# Altium project PCB_Project2.PrjPCB
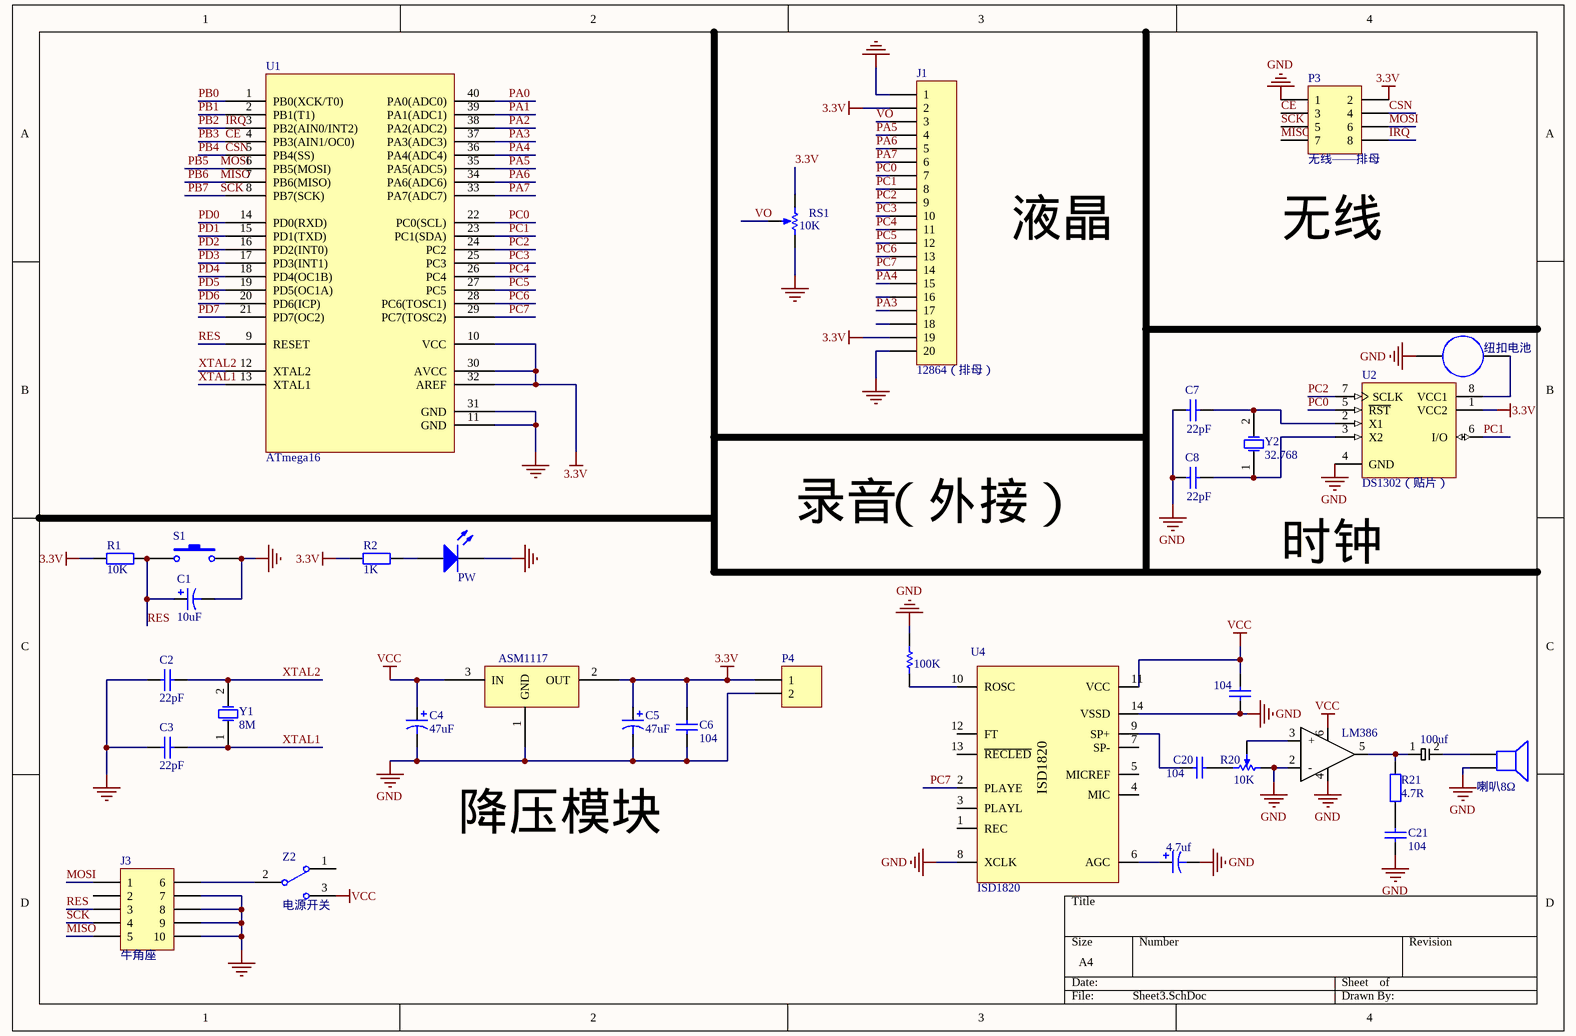
[diagram p0: Sheet3.SchDoc]
1 sheet, 35 parts. Net scope: global (net labels, ports and power ports of the same name join across sheets).
Board file: PCB1.PcbDoc

## Sheet Sheet3.SchDoc
size A4

### Parts
100K  value 100K  [0805]  (hidden comment: Res1)
100uf  (no value)  [电容]
104  value 104  [电容涤纶223]  (hidden comment: Cap)
1117_3.3V  ASM1117  [AMS1117-3.3V  SOT-223  贴片]
C1  value 10uF  [电容]
C2  value 22pF  [电容22pF]
C3  value 22pF  [电容22pF]
C4  value 47uF  [电容]
C5  value 47uF  [电容]
C6  value 104  [电容涤纶223]  (hidden comment: Cap)
C7  value 22pF  [电容22pF]  (hidden comment: Cap)
C8  value 22pF  [电容22pF]  (hidden comment: Cap)
C10  value 4.7uf  [电容]  (hidden comment: Cap Pol1)
C20  value 104  [电容22pF]
C21  value 104  [电容CBB224(0.22)]
J1  12864（排母）  [12864]
J3  牛角座  [下载口（12345）]
LM386  (no value)  [DIP 8]
LS  喇叭8Ω  [2排针]
P3  无线——排母  [无线模块]
P4  Header 2  [2排针]  (value not drawn)
PW  (no value)  [LED]
R1  value 10K  [0805]
R2  value 1K  [0805]
R20  10K  [小电位器]
R21  value 4.7R  [0805]
RS1  value 10K  [小电位器]
S1  (no value)  [4脚按键]
U1  ATmega16  [DIP 40 单片机]
U2  DS1302（贴片）  [SOP8（DS1302）]
U4  ISD1820  [14脚IC]
Y1  8M  [晶振]
Y2  32.768  [晶振]
Z2  电源开关  [自锁开关]
  纽扣电池  [电池座]

### Nets
3.3V: 1117_3.3V.2(OUT) C5.1 C6.1 J1.2 J1.19 P3.2 P4.1 R1.1 R2.1 RS1.1(TOP) U1.10(VCC) U1.30(AVCC) U1.32(AREF) U2.1(VCC2)
GND: 100K.1 104.1 1117_3.3V.1(GND) C1.2 C2.1 C3.1 C4.2 C5.2 C6.2 C7.1 C8.1 C10.2 C21.1 J1.1 J1.20 J3.7 J3.8 J3.9 J3.10 LM386.2(-) LM386.4 LS.2 P3.1 P4.2 PW.2(K) R20.3 RS1.2(BOT) S1.2 U1.11(GND) U1.31(GND) U2.4(GND) U4.8(XCLK) U4.14(VSSD) .2
VCC: 104.2 1117_3.3V.3(IN) C4.1 LM386.6 U4.11(VCC) Z2.3
CE: P3.3 U1.4(PB3(AIN1/OC0))  [also labelled PB3]
CSN: P3.4 U1.5(PB4(SS))  [also labelled PB4]
IRQ: P3.8 U1.3(PB2(AIN0/INT2))  [also labelled PB2]
MISO: J3.5 P3.7 U1.7(PB6(MISO))  [also labelled PB6]
MOSI: J3.1 P3.6 U1.6(PB5(MOSI))  [also labelled PB5]
PA0: U1.40(PA0(ADC0))
PA1: U1.39(PA1(ADC1))
PA2: U1.38(PA2(ADC2))
PA3: J1.17 U1.37(PA3(ADC3))
PA4: J1.15 U1.36(PA4(ADC4))
PA5: J1.4 U1.35(PA5(ADC5))
PA6: J1.5 U1.34(PA6(ADC6))
PA7: J1.6 U1.33(PA7(ADC7))
PB0: U1.1(PB0(XCK/T0))
PB1: U1.2(PB1(T1))
PB7: J3.4 P3.5 U1.8(PB7(SCK))  [also labelled SCK]
PC0: J1.7 U1.22(PC0(SCL)) U2.5(~{RST})
PC1: J1.8 U1.23(PC1(SDA)) U2.6(I/O)
PC2: J1.9 U1.24(PC2) U2.7(SCLK)
PC3: J1.10 U1.25(PC3)
PC4: J1.11 U1.26(PC4)
PC5: J1.12 U1.27(PC5)
PC6: J1.13 U1.28(PC6(TOSC1))
PC7: J1.14 U1.29(PC7(TOSC2)) U4.2(PLAYE)
PD0: U1.14(PD0(RXD))
PD1: U1.15(PD1(TXD))
PD2: U1.16(PD2(INT0))
PD3: U1.17(PD3(INT1))
PD4: U1.18(PD4(OC1B))
PD5: U1.19(PD5(OC1A))
PD6: U1.20(PD6(ICP))
PD7: U1.21(PD7(OC2))
RES: C1.1 J3.3 R1.2 S1.1 U1.9(RESET)
VO: J1.3 RS1.3(TAP)
XTAL1: C3.2 U1.13(XTAL1) Y1.1(OSC1)
XTAL2: C2.2 U1.12(XTAL2) Y1.2(OSC2)
Net100K_2: 100K.2 U4.10(ROSC)
Net100uf_1: 100uf.1 LM386.5 R21.2
Net100uf_2: 100uf.2 LS.1
NetC7_2: C7.2 U2.2(X1) Y2.2(OSC2)
NetC8_2: C8.2 U2.3(X2) Y2.1(OSC1)
NetC10_1: C10.1 U4.6(AGC)
NetC20_1: C20.1 U4.9(SP+)
NetC20_2: C20.2 R20.1
NetC21_2: C21.2 R21.1
NetJ3_6: J3.6 Z2.2
NetLM386_3: LM386.3(+) R20.2
NetPW_1: PW.1(A) R2.2
NetU2_8: U2.8(VCC1) .1

Not connected (* = marked no-connect by the designer): J1 16 18; J3 2; U4 1(REC) 3(PLAYL) 4(MIC) 5(MICREF) 7(SP-) 12(FT) 13(~{RECLED}); Z2 1

### Notes on the sheet
- Labels drawn without touching a wire or pin: 录音, 无线, 时钟, 液晶, 降压模块, （外接）

### Library data of the parts
100K = Res1: Resistor
100uf 1117_3.3V = Component_1
104 C2 C3 C6-C8 C20 C21 = Cap: Capacitor
C1 C4 C5 = Cap Pol3: Polarized Capacitor (Surface Mount); Published: 8-Jun-2000; LatestRevisionDate: 29-May-2009; LatestRevisionNote: IPC-7351 Footprint Added.; PackageReference: C0805; Publisher: Altium Limited; PackageDescription: Chip Capacitor
C10 = Cap Pol1: Polarized Capacitor (Radial); Published: 8-Jun-2000; LatestRevisionDate: 17-Jul-2002; LatestRevisionNote: Re-released for DXP Platform.; PackageReference: RB7.6-15; Publisher: Altium Limited
J1 = Header 20: Header, 20-Pin; LatestRevisionDate: 17-Jul-2002; LatestRevisionNote: Re-released for DXP Platform.; Publisher: Altium Limited
J3 = Header 5X2A: Header, 5-Pin, Dual row; LatestRevisionDate: 17-Jul-2002; LatestRevisionNote: Re-released for DXP Platform.; Publisher: Altium Limited
LM386 = LM386
LS = Speaker: Loudspeaker; Published: 24-Mar-1999; LatestRevisionDate: 17-Jul-2002; LatestRevisionNote: Re-released for DXP Platform.; PackageReference: PIN2; Publisher: Altium Limited
P3 = Header 4X2: Header, 4-Pin, Dual row; LatestRevisionDate: 17-Jul-2002; LatestRevisionNote: Re-released for DXP Platform.; Publisher: Altium Limited
P4 = Header 2: Header, 2-Pin; LatestRevisionDate: 17-Jul-2002; LatestRevisionNote: Re-released for DXP Platform.; Publisher: Altium Limited
PW = LED0: Typical INFRARED GaAs LED; Published: 8-Jun-2000; LatestRevisionDate: 08-Jul-2005; LatestRevisionNote: Mech Layer 1 removed.; PackageReference: LED-0; Publisher: Altium Limited
R1 R2 R21 = Res2: Resistor; Published: 8-Jun-2000; LatestRevisionDate: 17-Jul-2002; LatestRevisionNote: Re-released for DXP Platform.; PackageReference: AXIAL-0.4; Publisher: Altium Limited
R20 = RPot SM: Square Trimming Potentiometer; Published: 17-Dec-2003; DatasheetVersion: Oct-2003; PackageReference: POT4MM-2; Publisher: Altium Limited; ComponentLink1Description: Manufacturer Link; ComponentLink1URL: http://bourns.com/2/search.html
RS1 = RPot: Potentiometer; Sim Note: Enter the Resistance value and the set point into parameter fields.; Set Position: 0.5; Published: 8-Jun-2000; LatestRevisionDate: 17-Jul-2002; LatestRevisionNote: Re-released for DXP Platform.; PackageReference: VR5; Publisher: Altium Limited
S1 = SW-PB: Switch; Published: 24-Mar-1999; LatestRevisionDate: 17-Jul-2002; LatestRevisionNote: Re-released for DXP Platform.; PackageReference: SPST-2; Publisher: Altium Limited
U1 = Component_2
U2 = DS1302: Trickle Charge Timekeeping Chip; Published: 13-Oct-2000; LatestRevisionDate: 06-Jun-2005; LatestRevisionNote: Stylized 3D Model Added.; DatasheetVersion: 2-Jul-1999; PackageVersion: 1999; PackageReference: DIP8; Publisher: Altium Limited; PackageDescription: DIP; 8 Leads; Row Spacing 7.62 mm; Pitch 2.54 mm; ComponentLink1Description: Manufacturer Link; ComponentLink1URL: http://www.maxim-ic.com/; ComponentLink2Description: Datasheet; ComponentLink2URL: http://pdfserv.maxim-ic.com/en/ds/DS1302.pdf
U4 = ISD1810
Y1 Y2 = XTAL: Crystal Oscillator; Published: 8-Jun-2000; LatestRevisionDate: 17-Jul-2002; LatestRevisionNote: Re-released for DXP Platform.; PackageReference: R38; Publisher: Altium Limited
Z2 = SW-SPDT: SPDT Subminiature Toggle Switch, Right Angle Mounting, Vertical Actuation; Published: 24-Mar-1999; LatestRevisionDate: 17-Dec-2003; LatestRevisionNote: Schematic revised, PCB Footprint replaced.; DatasheetVersion: 05-Dec-2000; PackageReference: TL36WW15050; Publisher: Altium Limited; ComponentLink1Description: Manufacturer Link; ComponentLink1URL: http://www.apem.com
 = Meter: Indicating Instrument; Note: Place a "letter" into the symbol to show the function of the meter or instrument